# EAGLE design cnc-diff-line-driver (EAGLE 9.4.2)
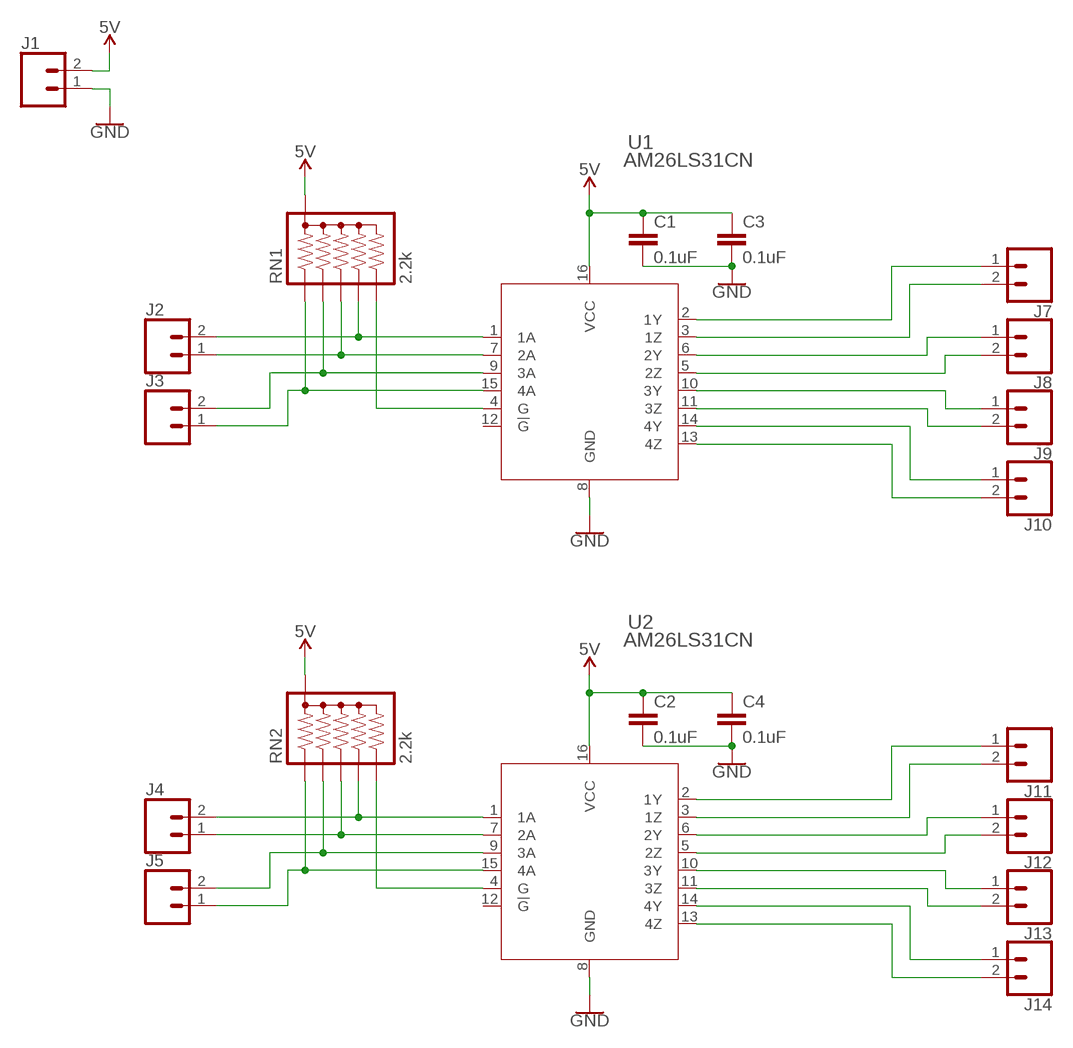
[diagram p0: schematic, sheet 1]

## Parts
C1  0.1uF  0.1UF-KIT-EZ-50V-20%  [CAP-PTH-SMALL-KIT]
C2  0.1uF  0.1UF-KIT-EZ-50V-20%  [CAP-PTH-SMALL-KIT]
C3  0.1uF  0.1UF-KIT-EZ-50V-20%  [CAP-PTH-SMALL-KIT]
C4  0.1uF  0.1UF-KIT-EZ-50V-20%  [CAP-PTH-SMALL-KIT]
J1  PHOENIX_CON_5.08MM_SCREW_1888687  [SCREWTERMINAL-5MM-2]
J2  PHOENIX_CON_5.08MM_SCREW_1888687  [SCREWTERMINAL-5MM-2]
J3  PHOENIX_CON_5.08MM_SCREW_1888687  [SCREWTERMINAL-5MM-2]
J4  PHOENIX_CON_5.08MM_SCREW_1888687  [SCREWTERMINAL-5MM-2]
J5  PHOENIX_CON_5.08MM_SCREW_1888687  [SCREWTERMINAL-5MM-2]
J7  PHOENIX_CON_5.08MM_SCREW_1888687  [SCREWTERMINAL-5MM-2]
J8  PHOENIX_CON_5.08MM_SCREW_1888687  [SCREWTERMINAL-5MM-2]
J9  PHOENIX_CON_5.08MM_SCREW_1888687  [SCREWTERMINAL-5MM-2]
J10  PHOENIX_CON_5.08MM_SCREW_1888687  [SCREWTERMINAL-5MM-2]
J11  PHOENIX_CON_5.08MM_SCREW_1888687  [SCREWTERMINAL-5MM-2]
J12  PHOENIX_CON_5.08MM_SCREW_1888687  [SCREWTERMINAL-5MM-2]
J13  PHOENIX_CON_5.08MM_SCREW_1888687  [SCREWTERMINAL-5MM-2]
J14  PHOENIX_CON_5.08MM_SCREW_1888687  [SCREWTERMINAL-5MM-2]
RN1  2.2k  10K_BUSSED_5  [RPACK-SIP-PTH-5]
RN2  2.2k  10K_BUSSED_5  [RPACK-SIP-PTH-5]
U1  AM26LS31CN  [N16]
U2  AM26LS31CN  [N16]

## Nets
5V: C1.1 C2.1 C3.1 C4.1 J1.2 RN1.P$1 RN2.P$1 U1.16(VCC) U2.16(VCC)
GND: C1.2 C2.2 C3.2 C4.2 J1.1 U1.8(GND) U2.8(GND)
N$1: J2.2 RN1.P$5 U1.1(1A)
N$2: J2.1 RN1.P$4 U1.7(2A)
N$3: J3.2 RN1.P$3 U1.9(3A)
N$4: J3.1 RN1.P$2 U1.15(4A)
N$5: RN1.P$6 U1.4(G)
N$6: J8.2 U1.5(2Z)
N$7: J8.1 U1.6(2Y)
N$8: J7.2 U1.3(1Z)
N$9: J7.1 U1.2(1Y)
N$10: J9.1 U1.10(3Y)
N$11: J9.2 U1.11(3Z)
N$12: J10.1 U1.14(4Y)
N$13: J10.2 U1.13(4Z)
N$14: J4.2 RN2.P$5 U2.1(1A)
N$15: J4.1 RN2.P$4 U2.7(2A)
N$16: J5.2 RN2.P$3 U2.9(3A)
N$17: J5.1 RN2.P$2 U2.15(4A)
N$18: RN2.P$6 U2.4(G)
N$19: J12.2 U2.5(2Z)
N$20: J12.1 U2.6(2Y)
N$21: J11.2 U2.3(1Z)
N$22: J11.1 U2.2(1Y)
N$23: J13.1 U2.10(3Y)
N$24: J13.2 U2.11(3Z)
N$25: J14.1 U2.14(4Y)
N$26: J14.2 U2.13(4Z)
Unconnected: U1.12(!G) U2.12(!G)

## Library data of the parts
C1-C4 = SparkFun-Capacitors:0.1UF: 0.1µF ceramic capacitors A capacitor is a passive two-terminal electrical component used to store electrical energy temporarily in an electric field.; PROD_ID: CAP-08370
J1-J5 J7-J14 = PHOENIX_CON_5.08MM_SCREW_1888687:PHOENIX_CON_5.08MM_SCREW_1888687
RN1 RN2 = SparkFun-Resistors:10K_BUSSED_5: 5 x 10kΩ resistor network A resistor is a passive two-terminal electrical component that implements electrical resistance as a circuit element. Resistors act to reduce current flow, and, at the same time, act to lower voltage levels within circuits. - Wikipedia This is a bussed or ladder network.; SF_SKU: COM-10856; VALUE: 10k
U1 U2 = AM26LS31CN:AM26LS31CN; MANUFACTURER_PART_NUMBER: AM26LS31CN; VENDOR: Texas Instruments

## Board
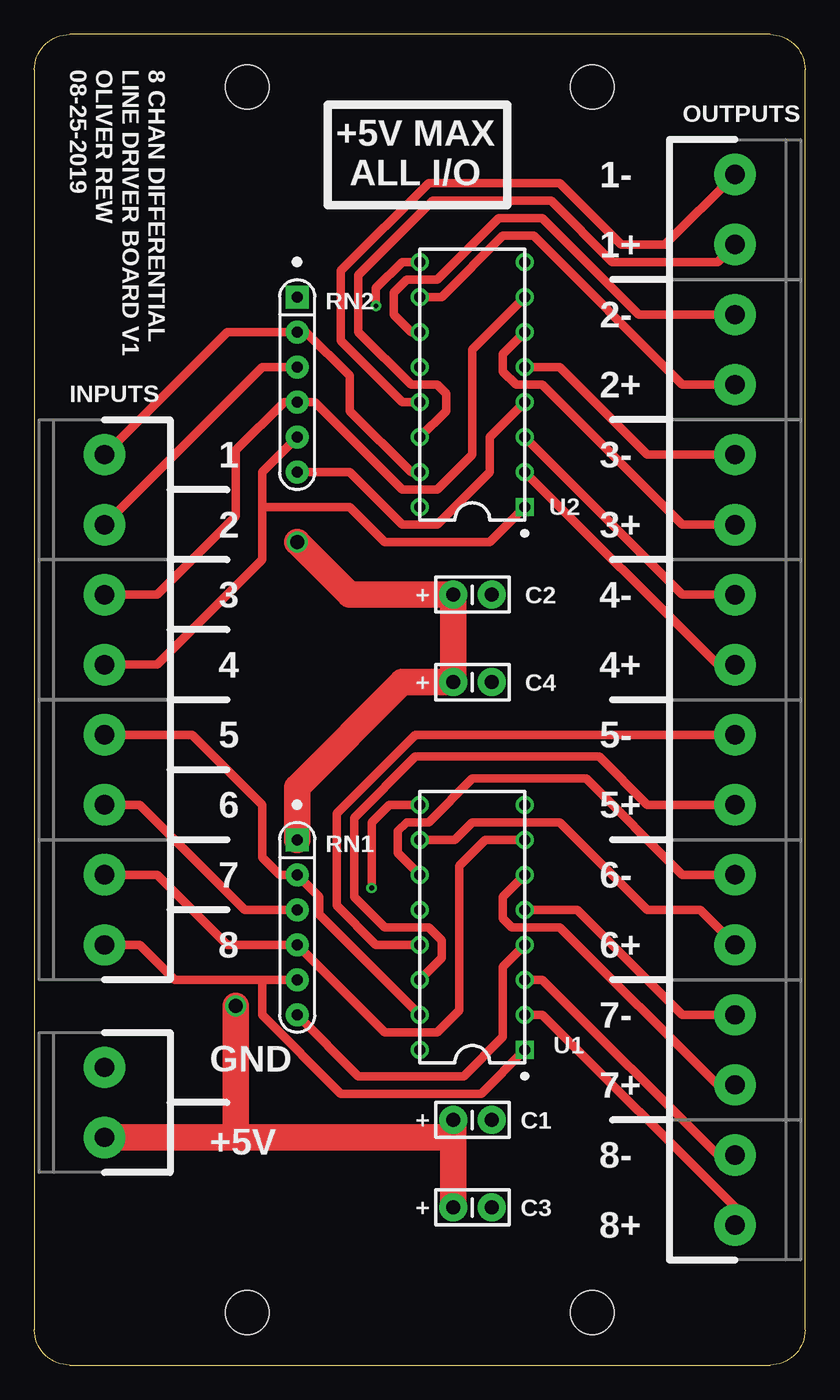
[diagram p1: board, top side]
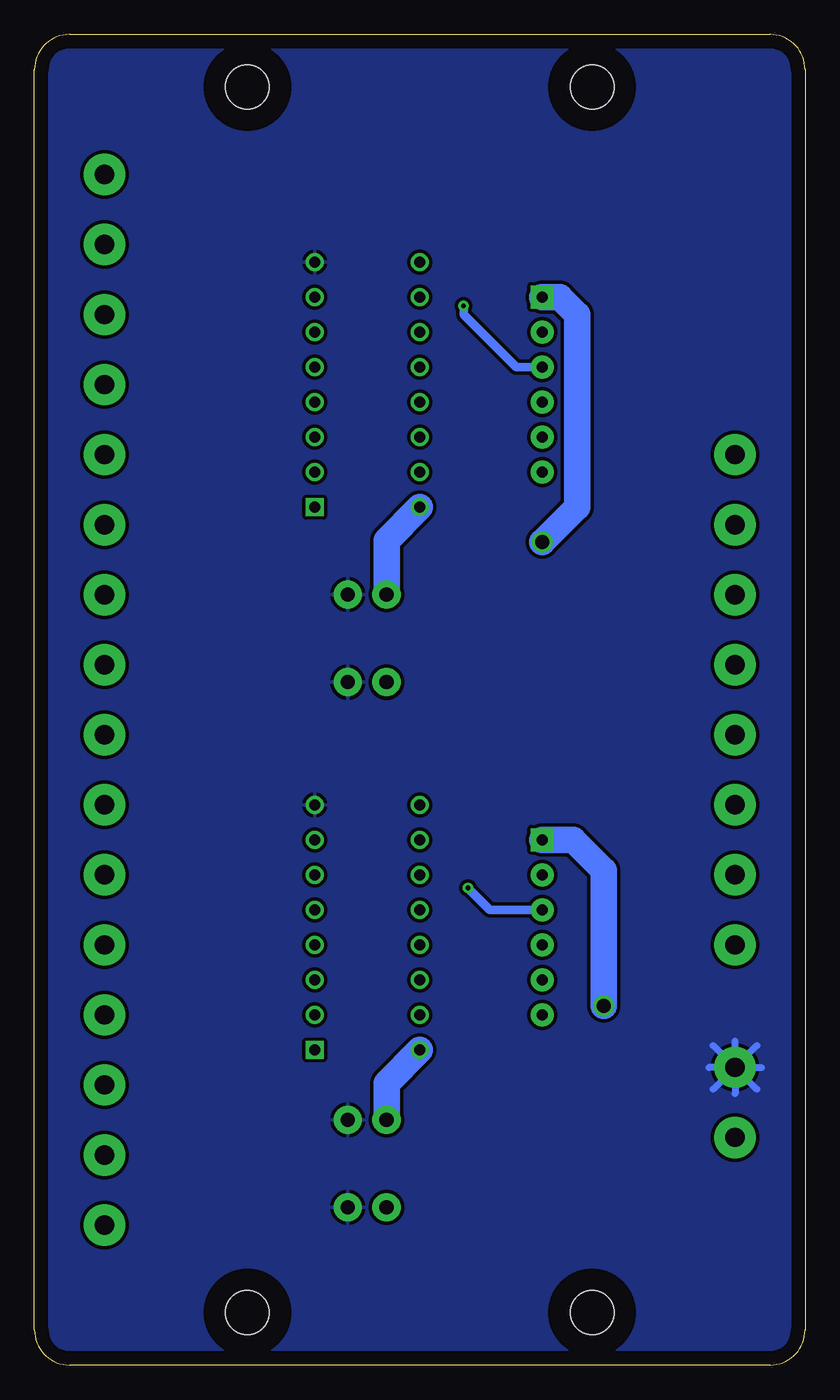
[diagram p2: board, bottom side, seen from below]

Size 55.88 x 96.52 mm. Coordinates in mm from the lower left corner, seen from the top.
Outline: 2.54,0 53.34,0 arc90 55.88,2.54 55.88,93.98 arc90 53.34,96.52 2.54,96.52 arc90 0,93.98 0,2.54 arc90 2.54,0
Copper layers (1*16): Top 0.035mm / dielectric 1.5mm / Bottom 0.035mm
Design rules "default *": minimum track width 10mil, minimum drill 0.35mm, track to track 10mil, track to pad 10mil, pad to pad 10mil, via to via 10mil, smd to smd 6mil, copper to edge 40mil, drill to drill 6mil, minimum pad ring 10mil, minimum via ring 8mil, stop-mask expansion 4mil, vias tented up to drill 0mil, thermal gap 10mil
Holes 3.17 mm at 15.44,3.81 40.44,3.81 15.44,92.71 40.44,92.71
tRestrict: area 13.9,2.2 to 17,5.4; area 38.9,2.2 to 42,5.4; area 13.9,91.1 to 17,94.3; area 38.9,91.1 to 42,94.3
bRestrict: area 13.9,2.2 to 17,5.4; area 38.9,2.2 to 42,5.4; area 13.9,91.1 to 17,94.3; area 38.9,91.1 to 42,94.3

### Footprints (pad centres in the part's own frame; a part is rotated, then mirrored left to right if it is on the bottom)
CAP-PTH-SMALL-KIT = drill 1.016 pad 2.032: 1 -1.397,0; 2 1.397,0
SCREWTERMINAL-5MM-2 = drill 1.4 pad 3: 1 0,0; 2 5.08,0
RPACK-SIP-PTH-5 = drill 0.8 pad 1.676 square: P$1 0,0 | drill 0.8 pad 1.676: P$2 0,-2.54; P$3 0,-5.08; P$4 0,-7.62; P$5 0,-10.16; P$6 0,-12.7
N16 = drill 0.787 pad 1.295 square: 1 -7.62,17.78 | drill 0.787 pad 1.295: 2 -7.62,15.24; 3 -7.62,12.7; 4 -7.62,10.16; 5 -7.62,7.62; 6 -7.62,5.08; 7 -7.62,2.54; 8 -7.62,0; 9 0,0; 10 0,2.54; 11 0,5.08; 12 0,7.62; 13 0,10.16; 14 0,12.7; 15 0,15.24; 16 0,17.78

### Placement (x,y rotation side)
C1  31.75,17.78 0 top
C2  31.75,55.88 0 top
C3  31.75,11.43 0 top
C4  31.75,49.53 0 top
J1  5.08,21.59 270 top
J2  5.08,35.56 270 top
J3  5.08,45.72 270 top
J4  5.08,55.88 270 top
J5  5.08,66.04 270 top
J7  50.8,10.16 90 top
J8  50.8,20.32 90 top
J9  50.8,30.48 90 top
J10  50.8,40.64 90 top
J11  50.8,50.8 90 top
J12  50.8,60.96 90 top
J13  50.8,71.12 90 top
J14  50.8,81.28 90 top
RN1  19.05,38.1 0 top
RN2  19.05,77.47 0 top
U1  27.94,40.64 180 top
U2  27.94,80.01 180 top

### Tracks (layer width: path | path; a pad name or v marks a point on that pad's centre or on a via)
5V  (via drill 1.02)
  Top 1.905: J1.2 13.97,16.51 | 13.97,16.51 30.16,16.51 | 30.16,16.51 30.35,16.7 C1.1 | C3.1 30.35,16.32 30.16,16.51 | RN1.P$1 19.05,41.91 26.67,49.53 C4.1 C2.1 22.86,55.88 v19.05,59.69 | v14.61,26.04 14.61,17.14 13.97,16.51
  Bottom 1.905: C1.1 30.35,20.45 U1.16 | C2.1 30.35,59.82 U2.16 | v19.05,59.69 16.51,62.23 16.51,76.2 17.78,77.47 RN2.P$1 | RN1.P$1 16.83,38.1 14.61,35.88 v14.61,26.04
GND
  Bottom 0.508: J1.1 6.67,20 | J1.1 3.49,20 | J1.1 3.49,23.18 | J1.1 6.67,23.18 | J1.1 5.08,23.5 | J1.1 3.17,21.59 | J1.1 6.99,21.59 | J1.1 5.08,19.68
  pour Bottom: -2.54,-2.54 58.42,-2.54 58.42,99.06 -2.54,99.06
N$1
  Top 0.61: J2.2 7.62,30.48 10.16,27.94 16.51,27.94 | 16.51,27.94 RN1.P$5 | 16.51,27.94 16.51,25.4 22.23,19.68 32.38,19.68 U1.1
N$2
  Top 0.61: J2.1 8.89,35.56 13.97,30.48 RN1.P$4 25.4,24.13 29.21,24.13 30.8,25.72 30.8,36.2 32.7,38.1 U1.7
N$3  (via drill 0.35)
  Top 0.61: J3.2 7.62,40.64 15.24,33.02 RN1.P$3 | U1.9 25.72,40.64 24.45,39.37 v24.45,34.61
  Bottom 0.61: RN1.P$3 22.86,33.02 v24.45,34.61
N$4
  Top 0.61: J3.1 11.43,45.72 16.51,40.64 16.51,36.83 17.78,35.56 RN1.P$2 20.64,33.97 20.64,32.7 U1.15
N$5
  Top 0.61: U1.4 33.97,28.89 33.97,23.81 31.11,20.95 23.5,20.95 RN1.P$6
N$6
  Top 0.61: U1.5 39.37,33.02 46.99,25.4 J8.2
N$7
  Top 0.61: U1.6 33.97,33.97 33.97,32.38 34.61,31.75 38.1,31.75 49.53,20.32 J8.1
N$8
  Top 0.61: U1.3 36.83,27.94 49.53,15.24 J7.2
N$9
  Top 0.61: U1.2 36.83,25.4 50.8,11.43 J7.1
N$10
  Top 0.61: J9.1 48.26,33.02 44.45,33.02 38.1,39.37 31.75,39.37 30.48,38.1 U1.10
N$11
  Top 0.61: J9.2 46.99,35.56 40.01,42.55 31.75,42.55 28.57,39.37 26.99,39.37 26.35,38.73 26.35,37.15 U1.11
N$12
  Top 0.61: U1.14 29.53,29.53 29.53,30.8 28.57,31.75 25.4,31.75 23.18,33.97 23.18,39.69 27.62,44.13 40.96,44.13 44.45,40.64 J10.1
N$13
  Top 0.61: U1.13 24.77,30.48 21.91,33.34 21.91,40.01 27.62,45.72 J10.2
N$14
  Top 0.61: J4.2 8.89,50.8 16.51,58.42 16.51,62.23 | RN2.P$5 16.51,64.77 16.51,62.23 | 16.51,62.23 22.86,62.23 25.4,59.69 33.02,59.69 U2.1
N$15
  Top 0.61: J4.1 8.89,55.88 14.61,61.59 14.61,66.36 18.1,69.85 RN2.P$4 20.32,69.85 26.67,63.5 29.21,63.5 31.75,66.04 31.75,73.66 U2.7
N$16  (via drill 0.35)
  Top 0.61: J5.2 16.51,72.39 RN2.P$3 | v24.77,76.83 24.77,78.11 26.67,80.01 U2.9
  Bottom 0.61: RN2.P$3 20.95,72.39 24.77,76.2 v24.77,76.83
N$17
  Top 0.61: U2.15 27.3,64.77 22.86,69.22 22.86,71.75 19.68,74.93 RN2.P$2 13.97,74.93 J5.1
N$18
  Top 0.61: RN2.P$6 22.86,64.77 26.67,60.96 29.21,60.96 33.02,64.77 33.02,67.31 U2.4
N$19
  Top 0.61: U2.5 38.1,72.39 44.45,66.04 J12.2
N$20
  Top 0.61: J12.1 46.99,60.96 36.83,71.12 34.92,71.12 33.97,72.07 33.97,73.34 U2.6
N$21
  Top 0.61: J11.2 46.99,55.88 U2.3
N$22
  Top 0.61: J11.1 49.53,50.8 U2.2
N$23
  Top 0.61: U2.10 29.53,77.47 33.97,81.92 36.2,81.92 46.99,71.12 J13.1
N$24
  Top 0.61: U2.11 27.3,74.93 26.04,76.2 26.04,77.79 26.99,78.74 29.21,78.74 33.66,83.19 36.83,83.19 43.81,76.2 J13.2
N$25
  Top 0.61: U2.14 29.84,69.22 29.84,70.48 29.21,71.12 27.3,71.12 23.5,74.93 23.5,79.06 28.89,84.45 37.47,84.45 41.91,80.01 49.53,80.01 J14.1
N$26
  Top 0.61: U2.13 26.67,69.85 22.23,74.3 22.23,79.38 28.57,85.72 38.1,85.72 42.55,81.28 45.72,81.28 J14.2

### Text on the board
tPlace: 8 CHAN DIFFERENTIAL / LINE DRIVER BOARD V1 / OLIVER REW / 08-25-2019 | OUTPUTS | +5V MAX / ALL I/O | 1- | 1+ | 2- | INPUTS | 2+ | 1 | 3- | 2 | 3+ | 3 | + | 4- | 4 | 4+ | + | 5 | 5- | 6 | 5+ | 7 | 6- | 8 | 6+ | 7- | GND | 7+ | + | +5V | 8- | + | 8+